# Altium project MAIN.PrjPcb (part 1 of 2)
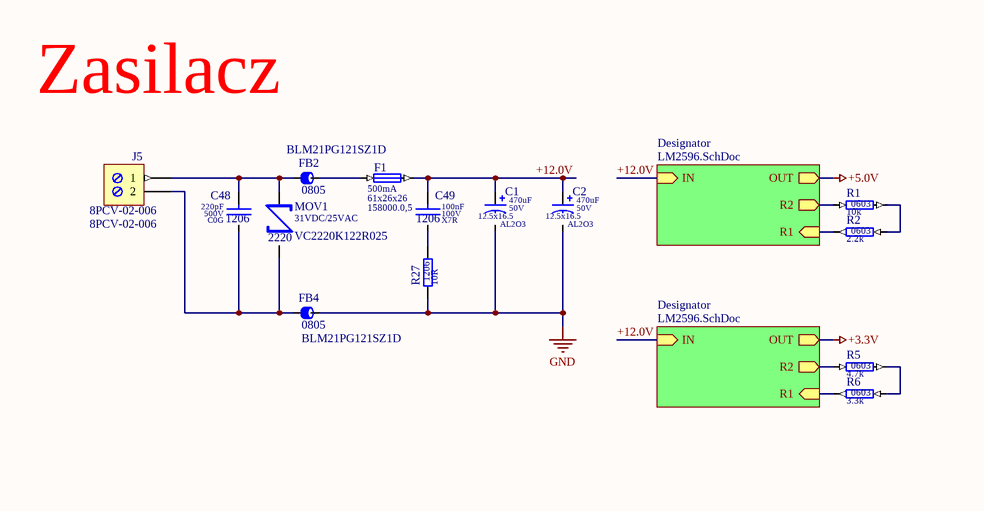
[diagram p0: MAIN.SchDoc, top left]
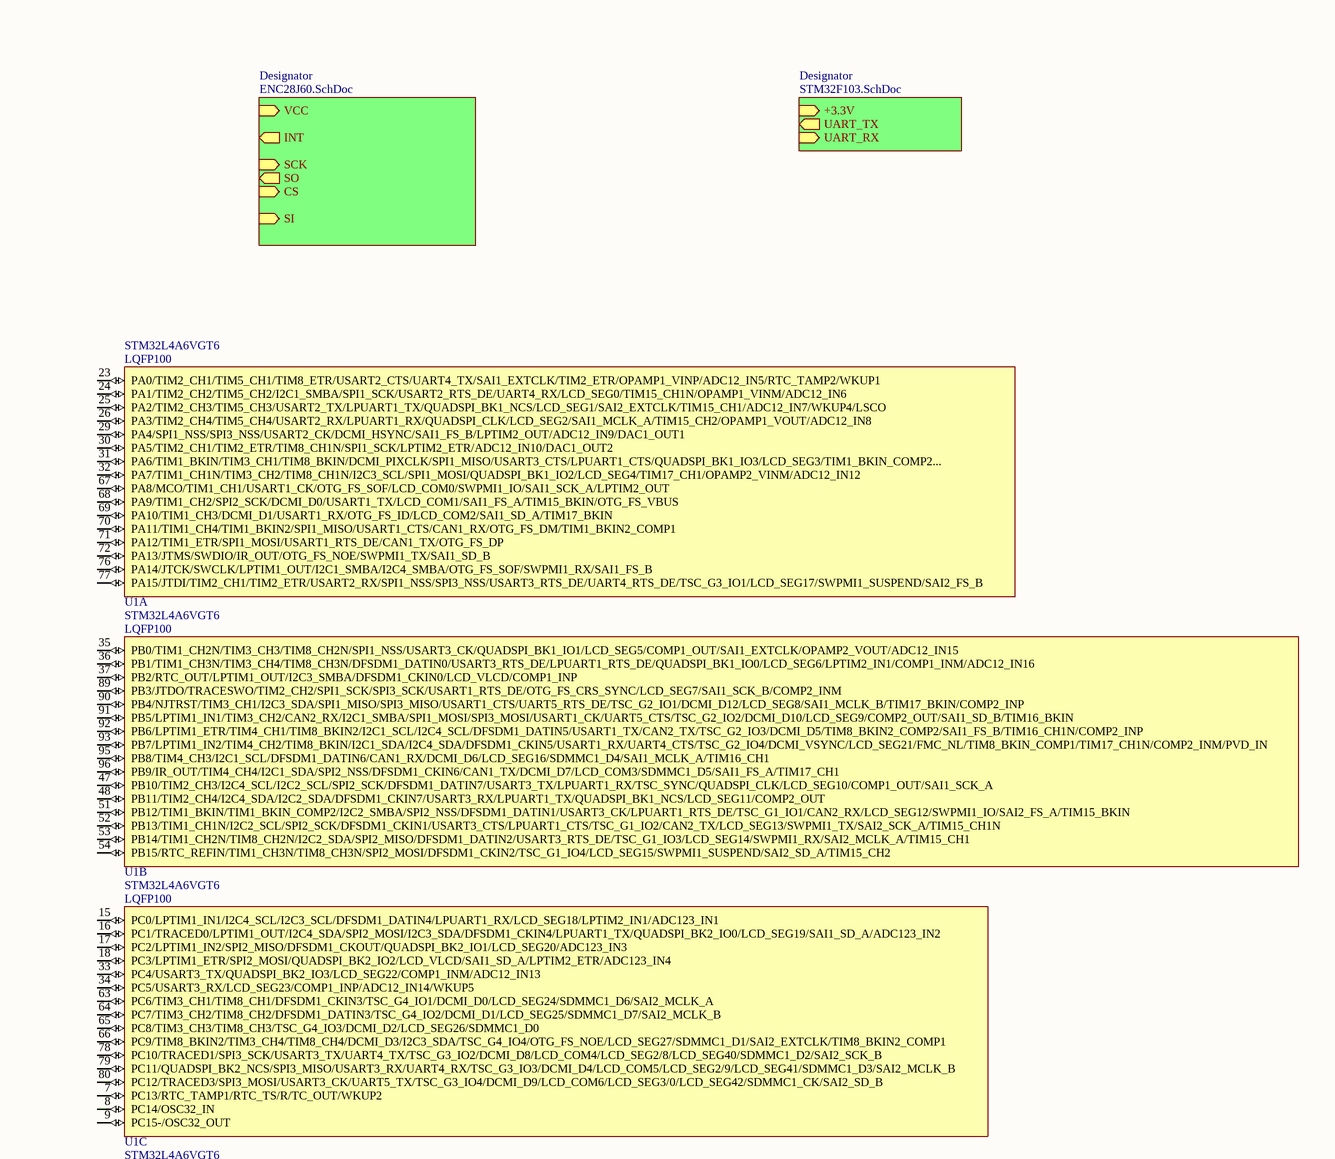
[diagram p1: MAIN.SchDoc, top right]
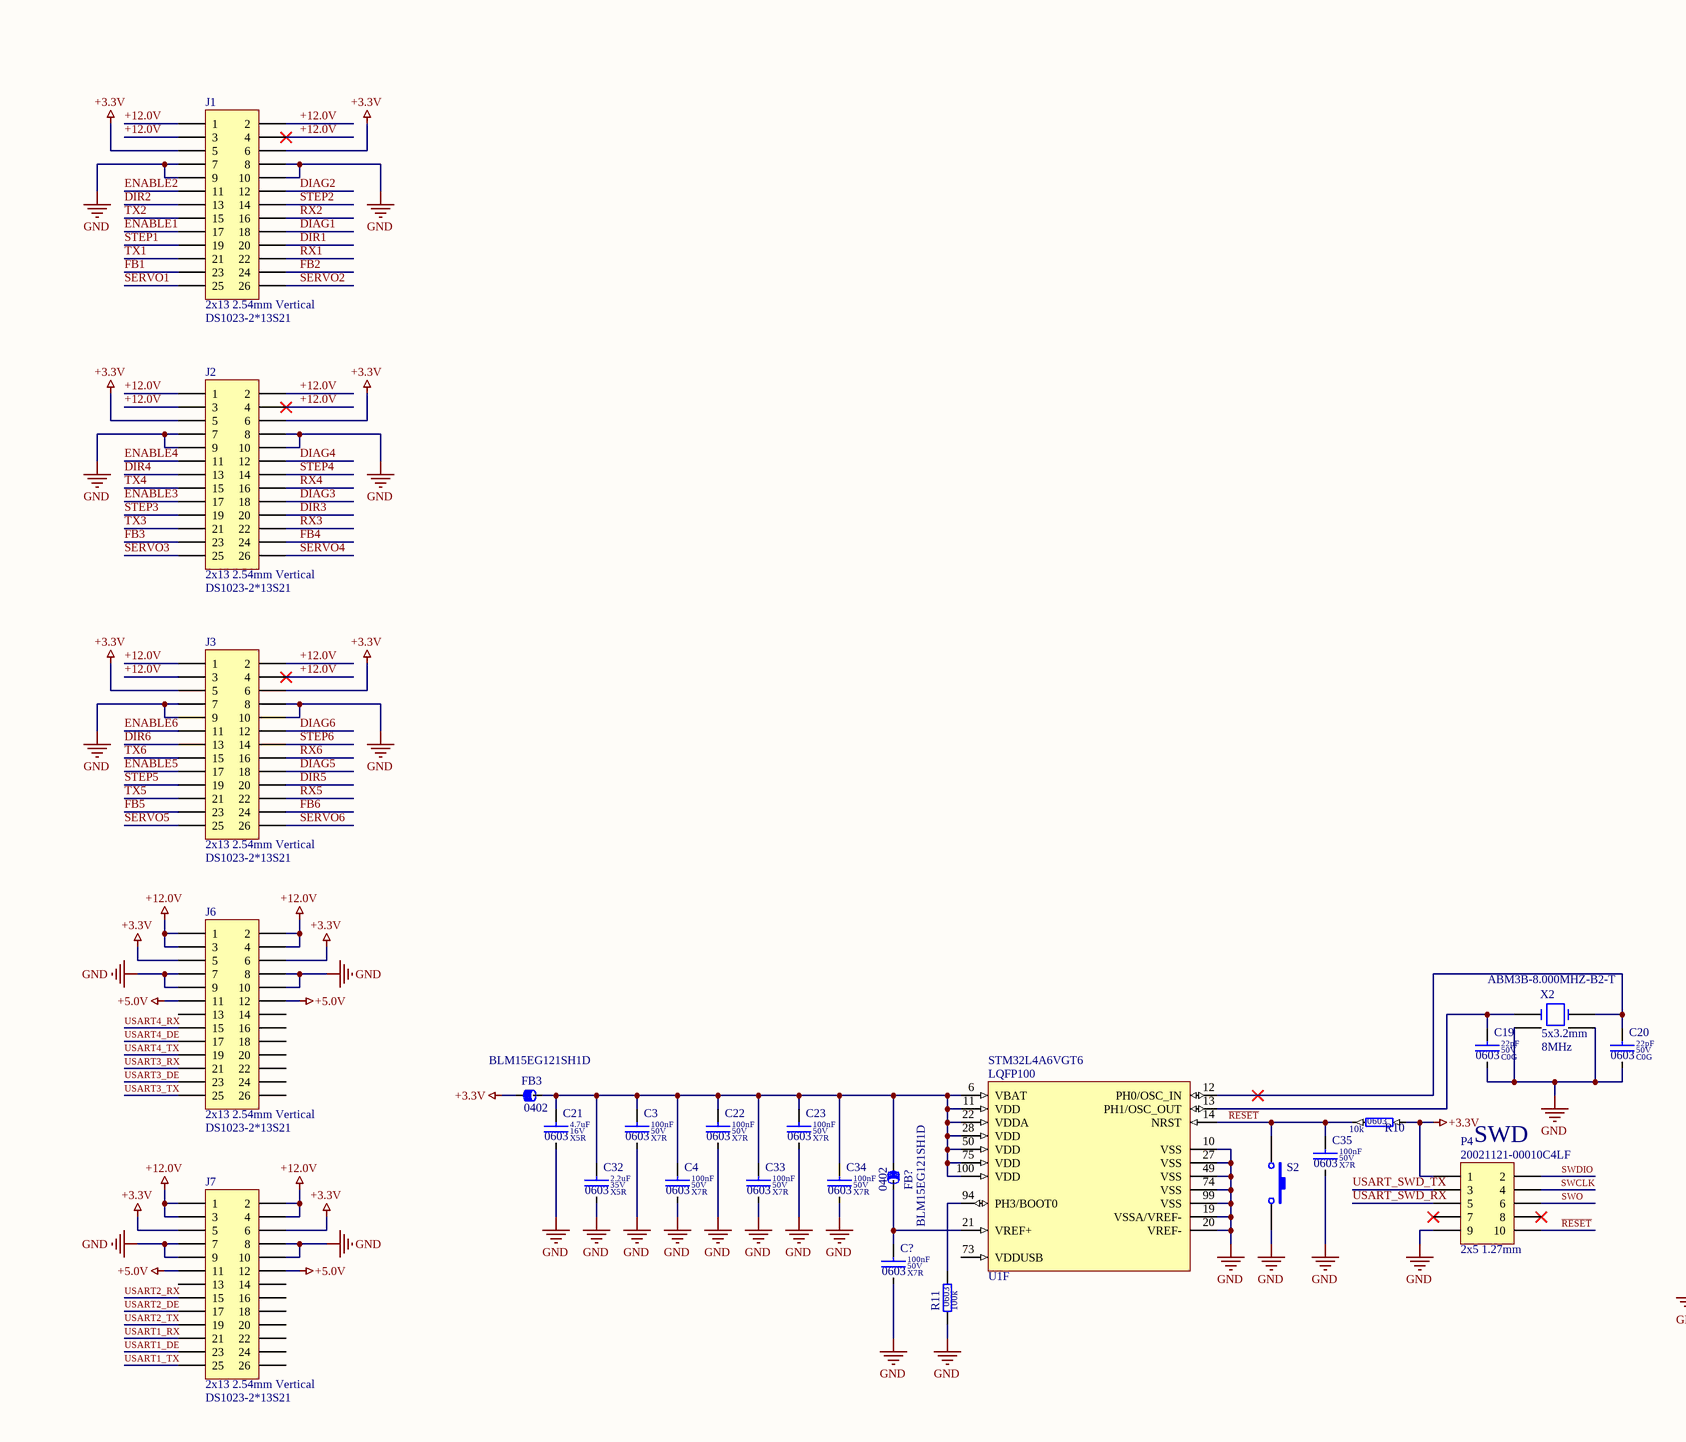
[diagram p2: MAIN.SchDoc, bottom left]
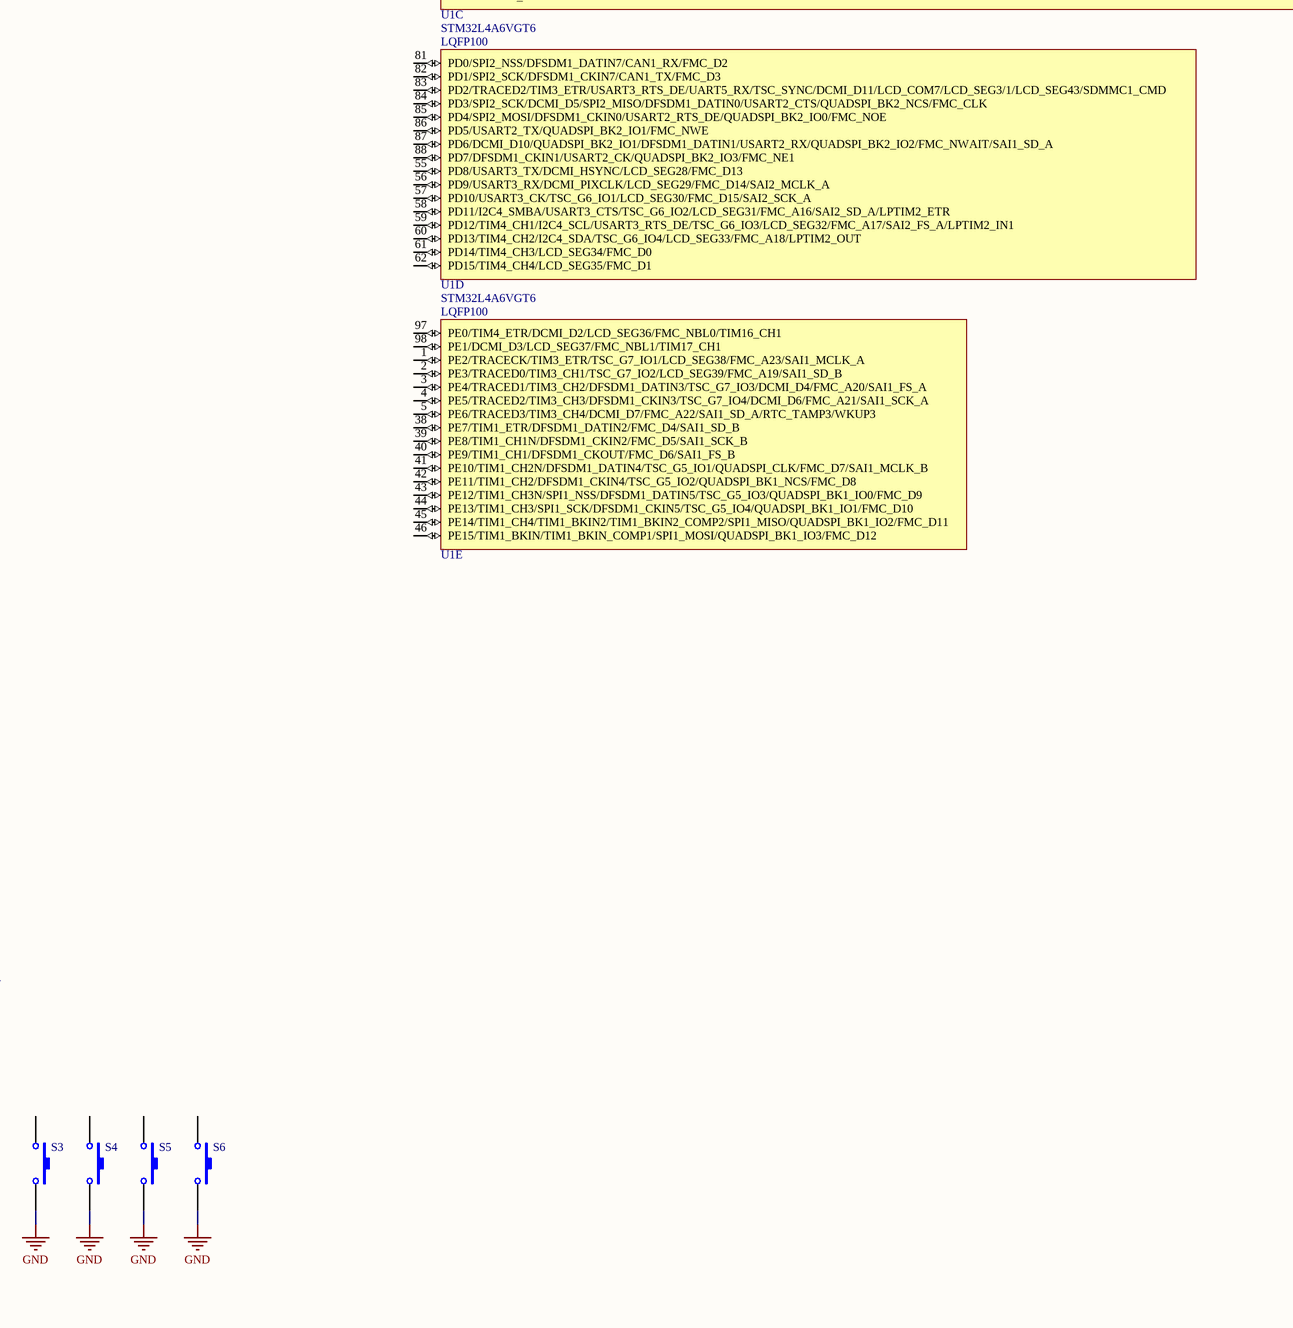
[diagram p3: MAIN.SchDoc, bottom right]
5 sheets, 129 parts. Net scope: hierarchical (ports join the sheet entries above them; power ports are global).
Board file: MAIN.PcbDoc
Sheets:
  MAIN.SchDoc
    Designator = STM32F103.SchDoc
      Designator = VL53L0X.SchDoc
      Designator = VL53L0X.SchDoc
      Designator = VL53L0X.SchDoc
      Designator = VL53L0X.SchDoc
      Designator = VL53L0X.SchDoc
      Designator = VL53L0X.SchDoc
    Designator = ENC28J60.SchDoc
    Designator = LM2596.SchDoc
    Designator = LM2596.SchDoc

## Sheet MAIN.SchDoc
size A1

### Parts
(Parts that share a designator on the sheet are numbered #1, #2 ... from top to bottom, then left to right.)
C1  value 470uF  Dielectric: AL2O3  SCH_Footprint: 12.5x16.5  Voltage: 50V  [CE_D_12.5x16.5MM]  (hidden comment: Electrolytic Capacitor)
C2  value 470uF  Dielectric: AL2O3  SCH_Footprint: 12.5x16.5  Voltage: 50V  [CE_D_12.5x16.5MM]  (hidden comment: Electrolytic Capacitor)
C3  value 100nF  Dielectric: X7R  Voltage: 50V  SCH_Footprint: 0603  [C_0603_1608]  (hidden comment: Ceramic X7R)
C4  value 100nF  Dielectric: X7R  Voltage: 50V  SCH_Footprint: 0603  [C_0603_1608]  (hidden comment: Ceramic X7R)
C19  value 22pF  Dielectric: C0G  Voltage: 50V  SCH_Footprint: 0603  [C_0603_1608]  (hidden comment: Ceramic C0G)
C20  value 22pF  Dielectric: C0G  Voltage: 50V  SCH_Footprint: 0603  [C_0603_1608]  (hidden comment: Ceramic C0G)
C21  value 4.7uF  Dielectric: X5R  Voltage: 16V  SCH_Footprint: 0603  [C_0603_1608]  (hidden comment: Ceramic X5R)
C22  value 100nF  Dielectric: X7R  Voltage: 50V  SCH_Footprint: 0603  [C_0603_1608]  (hidden comment: Ceramic X7R)
C23  value 100nF  Dielectric: X7R  Voltage: 50V  SCH_Footprint: 0603  [C_0603_1608]  (hidden comment: Ceramic X7R)
C32  value 2.2uF  Dielectric: X5R  Voltage: 35V  SCH_Footprint: 0603  [C_0603_1608]  (hidden comment: Ceramic X5R)
C33  value 100nF  Dielectric: X7R  Voltage: 50V  SCH_Footprint: 0603  [C_0603_1608]  (hidden comment: Ceramic X7R)
C34  value 100nF  Dielectric: X7R  Voltage: 50V  SCH_Footprint: 0603  [C_0603_1608]  (hidden comment: Ceramic X7R)
C35  value 100nF  Dielectric: X7R  Voltage: 50V  SCH_Footprint: 0603  [C_0603_1608]  (hidden comment: Ceramic X7R)
C48  value 220pF  Dielectric: C0G  Voltage: 500V  SCH_Footprint: 1206  [C_1206_3216]  (hidden comment: Ceramic C0G)
C49  value 100nF  Dielectric: X7R  Voltage: 100V  SCH_Footprint: 1206  [C_1206_3216]  (hidden comment: Ceramic X7R)
C?  value 100nF  Dielectric: X7R  Voltage: 50V  SCH_Footprint: 0603  [C_0603_1608]  (hidden comment: Ceramic X7R)
F1  value 158000.0,5  SCH_Footprint: 61x26x26  Current: 500mA  [F_SIBA_61x26x26_M]  (hidden comment: Fuse)
FB2  value BLM21PG121SZ1D  SCH_Footprint: 0805  [FB_0805_2012]  (hidden comment: Ferrite bead)
FB3  value BLM15EG121SH1D  SCH_Footprint: 0402  [FB_0402_1005]  (hidden comment: Ferrite bead)
FB4  value BLM21PG121SZ1D  SCH_Footprint: 0805  [FB_0805_2012]  (hidden comment: Ferrite bead)
FB?  value BLM15EG121SH1D  SCH_Footprint: 0402  [FB_0402_1005]  (hidden comment: Ferrite bead)
J1  value DS1023-2*13S21  SCH_Footprint: 2x13 2.54mm Vertical  [J_HEADER_2x13_2.54_VERTICAL]  (hidden comment: Goldpin female straight)
J2  value DS1023-2*13S21  SCH_Footprint: 2x13 2.54mm Vertical  [J_HEADER_2x13_2.54_VERTICAL]  (hidden comment: Goldpin female straight)
J3  value DS1023-2*13S21  SCH_Footprint: 2x13 2.54mm Vertical  [J_HEADER_2x13_2.54_VERTICAL]  (hidden comment: Goldpin female straight)
J5  value 8PCV-02-006  [J_8PCV-02-006]  (hidden comment: 600V 30A connector)
J6  value DS1023-2*13S21  SCH_Footprint: 2x13 2.54mm Vertical  [J_HEADER_2x13_2.54_VERTICAL]  (hidden comment: Goldpin female straight)
J7  value DS1023-2*13S21  SCH_Footprint: 2x13 2.54mm Vertical  [J_HEADER_2x13_2.54_VERTICAL]  (hidden comment: Goldpin female straight)
MOV1  Voltage: 31VDC/25VAC  [MOV_2220_5650]  (hidden comment: VC2220K122R025)
P4  value 20021121-00010C4LF  SCH_Footprint: 2x5 1.27mm  [P_HEADER_2x5_1.27]  (hidden comment: Jtag)
R1  value 10k  SCH_Footprint: 0603  [R_0603_1608]  (hidden comment: Resistor)
R2  value 2.2k  SCH_Footprint: 0603  [R_NC_0603_1608]  (hidden comment: Resistor)
R5#1  value 4.7k  SCH_Footprint: 0603  [R_0603_1608]  (hidden comment: Resistor)
R6  value 3.3k  SCH_Footprint: 0603  [R_0603_1608]  (hidden comment: Resistor)
R10  value 10k  SCH_Footprint: 0603  [R_0603_1608]  (hidden comment: Resistor)
R11  value 100k  SCH_Footprint: 0603  [R_0603_1608]  (hidden comment: Resistor)
R27  value 10R  SCH_Footprint: 1206  [R_1206_3216]  (hidden comment: Resistor)
S2  3x6mm  [S_TACTSWITCH3x6]  (value not drawn)
S3  3x6mm  [S_TACTSWITCH3x6]  (value not drawn)
S4  3x6mm  [S_TACTSWITCH3x6]  (value not drawn)
S5  3x6mm  [S_TACTSWITCH3x6]  (value not drawn)
S6  3x6mm  [S_TACTSWITCH3x6]  (value not drawn)
U1  SCH_Footprint: LQFP100  [LQFP100_14x14]  (hidden comment: STM32L4A6VGT6)  (parts A,B,C,D,E,F of 6)
X2  Manufacturer Part Number: ABM3B-8.000MHZ-B2-T  SCH_Footprint: 5x3.2mm  [X_ABM3B_5X3X11]  (hidden comment: 8MHz)

### Sub-sheets
Designator = STM32F103.SchDoc: +3.3V (in), UART_TX (out), UART_RX (in)
Designator = ENC28J60.SchDoc: SI (in), INT (out), SCK (in), VCC (in), SO (out), CS (in)
Designator = LM2596.SchDoc: OUT (out), R2 (out), R1 (in), IN (in)
Designator = LM2596.SchDoc: OUT (out), R2 (out), R1 (in), IN (in)

### Nets
+3.3V: FB3.1 J1.5 J1.6 J2.5 J2.6 J3.5 J3.6 J6.5 J6.6 J7.5 J7.6 P4.1 R5#1.1 R10.1 ; sheet Designator/OUT, sheet Designator/R2
+5.0V: J6.11 J6.12 J7.11 J7.12 R1.1 ; sheet Designator/OUT, sheet Designator/R2
+12.0V: C1.1 C2.1 C49.1 F1.2 J1.1 J1.2 J1.3 J1.4 J2.1 J2.2 J2.3 J2.4 J3.1 J3.2 J3.3 J3.4 J6.1 J6.2 J6.3 J6.4 J7.1 J7.2 J7.3 J7.4 ; sheet Designator/IN, sheet Designator/IN
GND: C1.2 C2.2 C3.2 C4.2 C19.2 C20.2 C21.2 C22.2 C23.2 C32.2 C33.2 C34.2 C35.2 C?.2 FB4.2 J1.7 J1.8 J1.9 J1.10 J2.7 J2.8 J2.9 J2.10 J3.7 J3.8 J3.9 J3.10 J6.7 J6.8 J6.9 J6.10 J7.7 J7.8 J7.9 J7.10 P4.9 R11.1 R27.1 S2.2 S3.2 S4.2 S5.2 S6.2 U1.10(VSS) U1.19(VSSA/VREF-) U1.20(VREF-) U1.27(VSS) U1.49(VSS) U1.74(VSS) U1.99(VSS) X2.2(GND) X2.4(GND)
DIAG1: J1.18
DIAG2: J1.12
DIAG3: J2.18
DIAG4: J2.12
DIAG5: J3.18
DIAG6: J3.12
DIR1: J1.20
DIR2: J1.13
DIR3: J2.20
DIR4: J2.13
DIR5: J3.20
DIR6: J3.13
ENABLE1: J1.17
ENABLE2: J1.11
ENABLE3: J2.17
ENABLE4: J2.11
ENABLE5: J3.17
ENABLE6: J3.11
FB1: J1.23
FB2: J1.24
FB3: J2.23
FB4: J2.24
FB5: J3.23
FB6: J3.24
~{RESET}: C35.1 P4.10 R10.2 S2.1 U1.14(NRST)
RX1: J1.22
RX2: J1.16
RX3: J2.22
RX4: J2.16
RX5: J3.22
RX6: J3.16
SERVO1: J1.25
SERVO2: J1.26
SERVO3: J2.25
SERVO4: J2.26
SERVO5: J3.25
SERVO6: J3.26
STEP1: J1.19
STEP2: J1.14
STEP3: J2.19
STEP4: J2.14
STEP5: J3.19
STEP6: J3.14
SWCLK: P4.4
SWDIO: P4.2
SWO: P4.6
TX1: J1.21
TX2: J1.15
TX3: J2.21
TX4: J2.15
TX5: J3.21
TX6: J3.15
USART1_DE: J7.23
USART1_RX: J7.21
USART1_TX: J7.25
USART2_DE: J7.17
USART2_RX: J7.15
USART2_TX: J7.19
USART3_DE: J6.23
USART3_RX: J6.21
USART3_TX: J6.25
USART4_DE: J6.17
USART4_RX: J6.15
USART4_TX: J6.19
USART_SWD_RX: P4.5
USART_SWD_TX: P4.3
NetC3_1: C3.1 C4.1 C21.1 C22.1 C23.1 C32.1 C33.1 C34.1 FB3.2 FB?.1 U1.6(VBAT) U1.11(VDD) U1.22(VDDA) U1.28(VDD) U1.50(VDD) U1.75(VDD) U1.100(VDD)
NetC19_1: C19.1 U1.13(PH1/OSC_OUT) X2.3
NetC20_1: C20.1 U1.12(PH0/OSC_IN) X2.1
NetC48_1: C48.1 FB2.1 J5.1 MOV1.2
NetC48_2: C48.2 FB4.1 J5.2 MOV1.1
NetC49_2: C49.2 R27.2
NetC?_1: C?.1 FB?.2 U1.21(VREF+)
NetF1_1: F1.1 FB2.2
NetR1_2: R1.2 R2.2
NetR2_1: R2.1 ; sheet Designator/R1
NetR5#1_2: R5#1.2 R6.2
NetR6_1: R6.1 ; sheet Designator/R1
NetR11_2: R11.2 U1.94(PH3/BOOT0)

Not connected (* = marked no-connect by the designer): J6 13 14 16 18 20 22 24 26; J7 13 14 16 18 20 22 24 26; P4 7* 8*; S3 1; S4 1; S5 1; S6 1; U1 1(PE2/TRACECK/TIM3_ETR/TSC_G7_IO1/LCD_SEG38/FMC_A23/SAI1_MCLK_A) 2(PE3/TRACED0/TIM3_CH1/TSC_G7_IO2/LCD_SEG39/FMC_A19/SAI1_SD_B) 3(PE4/TRACED1/TIM3_CH2/DFSDM1_DATIN3/TSC_G7_IO3/DCMI_D4/FMC_A20/SAI1_FS_A) 4(PE5/TRACED2/TIM3_CH3/DFSDM1_CKIN3/TSC_G7_IO4/DCMI_D6/FMC_A21/SAI1_SCK_A) 5(PE6/TRACED3/TIM3_CH4/DCMI_D7/FMC_A22/SAI1_SD_A/RTC_TAMP3/WKUP3) 7(PC13/RTC_TAMP1/RTC_TS/R/TC_OUT/WKUP2) 8(PC14/OSC32_IN) 9(PC15-/OSC32_OUT) 15(PC0/LPTIM1_IN1/I2C4_SCL/I2C3_SCL/DFSDM1_DATIN4/LPUART1_RX/LCD_SEG18/LPTIM2_IN1/ADC123_IN1) 16(PC1/TRACED0/LPTIM1_OUT/I2C4_SDA/SPI2_MOSI/I2C3_SDA/DFSDM1_CKIN4/LPUART1_TX/QUADSPI_BK2_IO0/LCD_SEG19/SAI1_SD_A/ADC123_IN2) 17(PC2/LPTIM1_IN2/SPI2_MISO/DFSDM1_CKOUT/QUADSPI_BK2_IO1/LCD_SEG20/ADC123_IN3) 18(PC3/LPTIM1_ETR/SPI2_MOSI/QUADSPI_BK2_IO2/LCD_VLCD/SAI1_SD_A/LPTIM2_ETR/ADC123_IN4) 23(PA0/TIM2_CH1/TIM5_CH1/TIM8_ETR/USART2_CTS/UART4_TX/SAI1_EXTCLK/TIM2_ETR/OPAMP1_VINP/ADC12_IN5/RTC_TAMP2/WKUP1) 24(PA1/TIM2_CH2/TIM5_CH2/I2C1_SMBA/SPI1_SCK/USART2_RTS_DE/UART4_RX/LCD_SEG0/TIM15_CH1N/OPAMP1_VINM/ADC12_IN6) 25(PA2/TIM2_CH3/TIM5_CH3/USART2_TX/LPUART1_TX/QUADSPI_BK1_NCS/LCD_SEG1/SAI2_EXTCLK/TIM15_CH1/ADC12_IN7/WKUP4/LSCO) 26(PA3/TIM2_CH4/TIM5_CH4/USART2_RX/LPUART1_RX/QUADSPI_CLK/LCD_SEG2/SAI1_MCLK_A/TIM15_CH2/OPAMP1_VOUT/ADC12_IN8) 29(PA4/SPI1_NSS/SPI3_NSS/USART2_CK/DCMI_HSYNC/SAI1_FS_B/LPTIM2_OUT/ADC12_IN9/DAC1_OUT1) 30(PA5/TIM2_CH1/TIM2_ETR/TIM8_CH1N/SPI1_SCK/LPTIM2_ETR/ADC12_IN10/DAC1_OUT2) 31(PA6/TIM1_BKIN/TIM3_CH1/TIM8_BKIN/DCMI_PIXCLK/SPI1_MISO/USART3_CTS/LPUART1_CTS/QUADSPI_BK1_IO3/LCD_SEG3/TIM1_BKIN_COMP2...) 32(PA7/TIM1_CH1N/TIM3_CH2/TIM8_CH1N/I2C3_SCL/SPI1_MOSI/QUADSPI_BK1_IO2/LCD_SEG4/TIM17_CH1/OPAMP2_VINM/ADC12_IN12) 33(PC4/USART3_TX/QUADSPI_BK2_IO3/LCD_SEG22/COMP1_INM/ADC12_IN13) 34(PC5/USART3_RX/LCD_SEG23/COMP1_INP/ADC12_IN14/WKUP5) 35(PB0/TIM1_CH2N/TIM3_CH3/TIM8_CH2N/SPI1_NSS/USART3_CK/QUADSPI_BK1_IO1/LCD_SEG5/COMP1_OUT/SAI1_EXTCLK/OPAMP2_VOUT/ADC12_IN15) 36(PB1/TIM1_CH3N/TIM3_CH4/TIM8_CH3N/DFSDM1_DATIN0/USART3_RTS_DE/LPUART1_RTS_DE/QUADSPI_BK1_IO0/LCD_SEG6/LPTIM2_IN1/COMP1_INM/ADC12_IN16) 37(PB2/RTC_OUT/LPTIM1_OUT/I2C3_SMBA/DFSDM1_CKIN0/LCD_VLCD/COMP1_INP) 38(PE7/TIM1_ETR/DFSDM1_DATIN2/FMC_D4/SAI1_SD_B) 39(PE8/TIM1_CH1N/DFSDM1_CKIN2/FMC_D5/SAI1_SCK_B) 40(PE9/TIM1_CH1/DFSDM1_CKOUT/FMC_D6/SAI1_FS_B) 41(PE10/TIM1_CH2N/DFSDM1_DATIN4/TSC_G5_IO1/QUADSPI_CLK/FMC_D7/SAI1_MCLK_B) 42(PE11/TIM1_CH2/DFSDM1_CKIN4/TSC_G5_IO2/QUADSPI_BK1_NCS/FMC_D8) 43(PE12/TIM1_CH3N/SPI1_NSS/DFSDM1_DATIN5/TSC_G5_IO3/QUADSPI_BK1_IO0/FMC_D9) 44(PE13/TIM1_CH3/SPI1_SCK/DFSDM1_CKIN5/TSC_G5_IO4/QUADSPI_BK1_IO1/FMC_D10) 45(PE14/TIM1_CH4/TIM1_BKIN2/TIM1_BKIN2_COMP2/SPI1_MISO/QUADSPI_BK1_IO2/FMC_D11) 46(PE15/TIM1_BKIN/TIM1_BKIN_COMP1/SPI1_MOSI/QUADSPI_BK1_IO3/FMC_D12) 47(PB10/TIM2_CH3/I2C4_SCL/I2C2_SCL/SPI2_SCK/DFSDM1_DATIN7/USART3_TX/LPUART1_RX/TSC_SYNC/QUADSPI_CLK/LCD_SEG10/COMP1_OUT/SAI1_SCK_A) 48(PB11/TIM2_CH4/I2C4_SDA/I2C2_SDA/DFSDM1_CKIN7/USART3_RX/LPUART1_TX/QUADSPI_BK1_NCS/LCD_SEG11/COMP2_OUT) 51(PB12/TIM1_BKIN/TIM1_BKIN_COMP2/I2C2_SMBA/SPI2_NSS/DFSDM1_DATIN1/USART3_CK/LPUART1_RTS_DE/TSC_G1_IO1/CAN2_RX/LCD_SEG12/SWPMI1_IO/SAI2_FS_A/TIM15_BKIN) 52(PB13/TIM1_CH1N/I2C2_SCL/SPI2_SCK/DFSDM1_CKIN1/USART3_CTS/LPUART1_CTS/TSC_G1_IO2/CAN2_TX/LCD_SEG13/SWPMI1_TX/SAI2_SCK_A/TIM15_CH1N) 53(PB14/TIM1_CH2N/TIM8_CH2N/I2C2_SDA/SPI2_MISO/DFSDM1_DATIN2/USART3_RTS_DE/TSC_G1_IO3/LCD_SEG14/SWPMI1_RX/SAI2_MCLK_A/TIM15_CH1) 54(PB15/RTC_REFIN/TIM1_CH3N/TIM8_CH3N/SPI2_MOSI/DFSDM1_CKIN2/TSC_G1_IO4/LCD_SEG15/SWPMI1_SUSPEND/SAI2_SD_A/TIM15_CH2) 55(PD8/USART3_TX/DCMI_HSYNC/LCD_SEG28/FMC_D13) 56(PD9/USART3_RX/DCMI_PIXCLK/LCD_SEG29/FMC_D14/SAI2_MCLK_A) 57(PD10/USART3_CK/TSC_G6_IO1/LCD_SEG30/FMC_D15/SAI2_SCK_A) 58(PD11/I2C4_SMBA/USART3_CTS/TSC_G6_IO2/LCD_SEG31/FMC_A16/SAI2_SD_A/LPTIM2_ETR) 59(PD12/TIM4_CH1/I2C4_SCL/USART3_RTS_DE/TSC_G6_IO3/LCD_SEG32/FMC_A17/SAI2_FS_A/LPTIM2_IN1) 60(PD13/TIM4_CH2/I2C4_SDA/TSC_G6_IO4/LCD_SEG33/FMC_A18/LPTIM2_OUT) 61(PD14/TIM4_CH3/LCD_SEG34/FMC_D0) 62(PD15/TIM4_CH4/LCD_SEG35/FMC_D1) 63(PC6/TIM3_CH1/TIM8_CH1/DFSDM1_CKIN3/TSC_G4_IO1/DCMI_D0/LCD_SEG24/SDMMC1_D6/SAI2_MCLK_A) 64(PC7/TIM3_CH2/TIM8_CH2/DFSDM1_DATIN3/TSC_G4_IO2/DCMI_D1/LCD_SEG25/SDMMC1_D7/SAI2_MCLK_B) 65(PC8/TIM3_CH3/TIM8_CH3/TSC_G4_IO3/DCMI_D2/LCD_SEG26/SDMMC1_D0) 66(PC9/TIM8_BKIN2/TIM3_CH4/TIM8_CH4/DCMI_D3/I2C3_SDA/TSC_G4_IO4/OTG_FS_NOE/LCD_SEG27/SDMMC1_D1/SAI2_EXTCLK/TIM8_BKIN2_COMP1) 67(PA8/MCO/TIM1_CH1/USART1_CK/OTG_FS_SOF/LCD_COM0/SWPMI1_IO/SAI1_SCK_A/LPTIM2_OUT) 68(PA9/TIM1_CH2/SPI2_SCK/DCMI_D0/USART1_TX/LCD_COM1/SAI1_FS_A/TIM15_BKIN/OTG_FS_VBUS) 69(PA10/TIM1_CH3/DCMI_D1/USART1_RX/OTG_FS_ID/LCD_COM2/SAI1_SD_A/TIM17_BKIN) 70(PA11/TIM1_CH4/TIM1_BKIN2/SPI1_MISO/USART1_CTS/CAN1_RX/OTG_FS_DM/TIM1_BKIN2_COMP1) 71(PA12/TIM1_ETR/SPI1_MOSI/USART1_RTS_DE/CAN1_TX/OTG_FS_DP) 72(PA13/JTMS/SWDIO/IR_OUT/OTG_FS_NOE/SWPMI1_TX/SAI1_SD_B) 73(VDDUSB) 76(PA14/JTCK/SWCLK/LPTIM1_OUT/I2C1_SMBA/I2C4_SMBA/OTG_FS_SOF/SWPMI1_RX/SAI1_FS_B) 77(PA15/JTDI/TIM2_CH1/TIM2_ETR/USART2_RX/SPI1_NSS/SPI3_NSS/USART3_RTS_DE/UART4_RTS_DE/TSC_G3_IO1/LCD_SEG17/SWPMI1_SUSPEND/SAI2_FS_B) 78(PC10/TRACED1/SPI3_SCK/USART3_TX/UART4_TX/TSC_G3_IO2/DCMI_D8/LCD_COM4/LCD_SEG2/8/LCD_SEG40/SDMMC1_D2/SAI2_SCK_B) 79(PC11/QUADSPI_BK2_NCS/SPI3_MISO/USART3_RX/UART4_RX/TSC_G3_IO3/DCMI_D4/LCD_COM5/LCD_SEG2/9/LCD_SEG41/SDMMC1_D3/SAI2_MCLK_B) 80(PC12/TRACED3/SPI3_MOSI/USART3_CK/UART5_TX/TSC_G3_IO4/DCMI_D9/LCD_COM6/LCD_SEG3/0/LCD_SEG42/SDMMC1_CK/SAI2_SD_B) 81(PD0/SPI2_NSS/DFSDM1_DATIN7/CAN1_RX/FMC_D2) 82(PD1/SPI2_SCK/DFSDM1_CKIN7/CAN1_TX/FMC_D3) 83(PD2/TRACED2/TIM3_ETR/USART3_RTS_DE/UART5_RX/TSC_SYNC/DCMI_D11/LCD_COM7/LCD_SEG3/1/LCD_SEG43/SDMMC1_CMD) 84(PD3/SPI2_SCK/DCMI_D5/SPI2_MISO/DFSDM1_DATIN0/USART2_CTS/QUADSPI_BK2_NCS/FMC_CLK) 85(PD4/SPI2_MOSI/DFSDM1_CKIN0/USART2_RTS_DE/QUADSPI_BK2_IO0/FMC_NOE) 86(PD5/USART2_TX/QUADSPI_BK2_IO1/FMC_NWE) 87(PD6/DCMI_D10/QUADSPI_BK2_IO1/DFSDM1_DATIN1/USART2_RX/QUADSPI_BK2_IO2/FMC_NWAIT/SAI1_SD_A) 88(PD7/DFSDM1_CKIN1/USART2_CK/QUADSPI_BK2_IO3/FMC_NE1) 89(PB3/JTDO/TRACESWO/TIM2_CH2/SPI1_SCK/SPI3_SCK/USART1_RTS_DE/OTG_FS_CRS_SYNC/LCD_SEG7/SAI1_SCK_B/COMP2_INM) 90(PB4/NJTRST/TIM3_CH1/I2C3_SDA/SPI1_MISO/SPI3_MISO/USART1_CTS/UART5_RTS_DE/TSC_G2_IO1/DCMI_D12/LCD_SEG8/SAI1_MCLK_B/TIM17_BKIN/COMP2_INP) 91(PB5/LPTIM1_IN1/TIM3_CH2/CAN2_RX/I2C1_SMBA/SPI1_MOSI/SPI3_MOSI/USART1_CK/UART5_CTS/TSC_G2_IO2/DCMI_D10/LCD_SEG9/COMP2_OUT/SAI1_SD_B/TIM16_BKIN) 92(PB6/LPTIM1_ETR/TIM4_CH1/TIM8_BKIN2/I2C1_SCL/I2C4_SCL/DFSDM1_DATIN5/USART1_TX/CAN2_TX/TSC_G2_IO3/DCMI_D5/TIM8_BKIN2_COMP2/SAI1_FS_B/TIM16_CH1N/COMP2_INP) 93(PB7/LPTIM1_IN2/TIM4_CH2/TIM8_BKIN/I2C1_SDA/I2C4_SDA/DFSDM1_CKIN5/USART1_RX/UART4_CTS/TSC_G2_IO4/DCMI_VSYNC/LCD_SEG21/FMC_NL/TIM8_BKIN_COMP1/TIM17_CH1N/COMP2_INM/PVD_IN) 95(PB8/TIM4_CH3/I2C1_SCL/DFSDM1_DATIN6/CAN1_RX/DCMI_D6/LCD_SEG16/SDMMC1_D4/SAI1_MCLK_A/TIM16_CH1) 96(PB9/IR_OUT/TIM4_CH4/I2C1_SDA/SPI2_NSS/DFSDM1_CKIN6/CAN1_TX/DCMI_D7/LCD_COM3/SDMMC1_D5/SAI1_FS_A/TIM17_CH1) 97(PE0/TIM4_ETR/DCMI_D2/LCD_SEG36/FMC_NBL0/TIM16_CH1) 98(PE1/DCMI_D3/LCD_SEG37/FMC_NBL1/TIM17_CH1)

### Notes on the sheet
- Zasilacz
- (near P4) SWD
- Title
- Size:
- Date:
- File:
- A1
- Number:
- Time:
- Revision:
- Sheet
- of

### Library data of the parts
C1 C2 = CE_470uF_50V_AL2O3_12.5x16.5_20: Polarized Capacitor; Manufacturer: United Chemi-Con; Manufacturer Part Number: EMVA500ARA471MKG5S; Tolerance (%): 20; Part Number: CE_470uF_50V_AL2O3_12.5x16.5_20; HelpURL: https://datasheet.octopart.com/EMVA500ARA471MKG5S-United-Chemi-Con-datasheet-15540548.pdf; Supplier 1: TME; Supplier 2: RS Components; Supplier 3: Farnell; Supplier Part Number 3: 2842044; Supplier 4: Mouser; Supplier Part Number 4: 661-EMVA500ARA471MKG; Supplier 5: Digi-Key; Supplier Part Number 5: 565-2136-1-ND; Supplier 6: LCSC
C3 C4 C22 C23 C33-C35 C? = C_100nF_50V_X7R_0603_5: Capacitor; Manufacturer: Samsung; Manufacturer Part Number: CL10B104JB8NNNC; Tolerance (%): 5; Part Number: C_100nF_50V_X7R_0603_5; HelpURL: http://www.tme.eu/pl/Document/4a42202b32dab16128fe107dd69598cc/samsung-chip-cap.pdf; Supplier 1: TME; Supplier Part Number 1: CL10B104JB8NNNC; Supplier 2: RS Components; Supplier Part Number 2: 7665455; Supplier 3: Farnell; Supplier 4: Mouser; Supplier 5: Digi-Key; Supplier Part Number 5: 1276-1033-1-ND; Supplier 6: LCSC; Supplier Part Number 6: C24452
C19 C20 = C_22pF_50V_C0G_0603_5: Capacitor; Manufacturer: Yageo; Manufacturer Part Number: CC0603JRNPO9BN220; Tolerance (%): 5; Part Number: C_22pF_50V_C0G_0603_5; HelpURL: https://datasheet.octopart.com/CC0603JRNPO9BN220-Yageo-datasheet-136957424.pdf; Supplier 1: TME; Supplier Part Number 1: CC0603JRNPO9220; Supplier 2: RS Components; Supplier 3: Farnell; Supplier Part Number 3: 722005; Supplier 4: Mouser; Supplier Part Number 4: 603-CC603JRNPO9BN220; Supplier 5: Digi-Key; Supplier Part Number 5: 311-1062-1-ND; Supplier 6: LCSC
C21 = C_4.7uF_16V_X5R_0603_10: Capacitor; Manufacturer: Murata; Manufacturer Part Number: GRM188R61C475KAAJD; Tolerance (%): 10; Part Number: C_4.7uF_16V_X5R_0603_10; HelpURL: https://datasheet.octopart.com/GRM188R61C475KAAJD-Murata-datasheet-66077093.pdf; Supplier 1: TME; Supplier 2: RS Components; Supplier Part Number 2: 884-7264P; Supplier 3: Farnell; Supplier Part Number 3: 2611924; Supplier 4: Mouser; Supplier Part Number 4: 81-GRM188R61C475KAJD; Supplier 5: Digi-Key; Supplier Part Number 5: 490-10481-2-ND; Supplier 6: LCSC
C32 = C_2.2uF_35V_X5R_0603_10: Capacitor; Manufacturer: Murata; Manufacturer Part Number: GRM188R6YA225KA12D; Tolerance (%): 10; Part Number: C_2.2uF_35V_X5R_0603_10; HelpURL: https://datasheet.octopart.com/GRM188R6YA225KA12D-Murata-datasheet-66077095.pdf; Supplier 1: TME; Supplier 2: RS Components; Supplier Part Number 2: 8151358; Supplier 3: Farnell; Supplier Part Number 3: 2611926; Supplier 4: Mouser; Supplier Part Number 4: 81-GRM188R6YA225KA2D; Supplier 5: Digi-Key; Supplier Part Number 5: 490-7204-1-ND; Supplier 6: LCSC
C48 = C_220pF_500V_C0G_1206_5: Capacitor; Manufacturer: AVX; Manufacturer Part Number: 12067A221JAT2A; Tolerance (%): 5; Part Number: C_220pF_500V_C0G_1206_5; HelpURL: http://datasheet.octopart.com/12067A221JAT2A-AVX-datasheet-9883399.pdf; Supplier 1: TME; Supplier 2: RS Components; Supplier Part Number 2: 391022; Supplier 3: Farnell; Supplier Part Number 3: 2281102; Supplier 4: Mouser; Supplier Part Number 4: 581-12067A221J; Supplier 5: Digi-Key; Supplier Part Number 5: 478-5785-1-ND; Supplier 6: LCSC
C49 = C_100nF_100V_X7R_1206_10: Capacitor; Manufacturer: Samsung; Manufacturer Part Number: CL31B104KCFNNNE; Tolerance (%): 10; Part Number: C_100nF_100V_X7R_1206_10; HelpURL: https://datasheet.octopart.com/CL31B104KCFNNNE-Samsung-datasheet-8331463.pdf; Supplier 1: TME; Supplier 2: RS Components; Supplier 3: Farnell; Supplier 4: Mouser; Supplier 5: Digi-Key; Supplier 6: LCSC
F1 = F_500mA_125V_61x26x26: Manufacturer: Siba; Voltage: 125V; Part Number: F_500mA_125V_61x26x26; HelpURL: https://www.tme.eu/Document/2b36e94e6d725b87cfb40ef3a8fef910/SIBA-GSS-158000.pdf; Manufacturer Part Number: 158000.0,5; Supplier 1: TME; Supplier Part Number 1: BSMD-T0.5A; Supplier 2: RS Components; Supplier 3: Farnell; Supplier 4: Mouser; Supplier 5: Digi-Key; Supplier 6: LCSC
FB2 FB4 = FB_BLM21PG121SZ1D: Manufacturer: Murata; Current: 3A; Resistance: 30mR; Part Number: FB_BLM21PG121SZ1D; HelpURL: https://datasheet.octopart.com/BLM21PG121SZ1D-Murata-datasheet-138707404.pdf; Manufacturer Part Number: BLM21PG121SZ1D; Supplier 1: TME; Supplier 2: RS Components; Supplier 3: Farnell; Supplier Part Number 3: 3352923; Supplier 4: Mouser; Supplier Part Number 4: 81-BLM21PG121SZ1D; Supplier 5: Digi-Key; Supplier Part Number 5: 490-18101-1-ND; Supplier 6: LCSC
FB3 FB? = FB_BLM15EG121SH1D: Manufacturer: Murata; Current: 1.5A; Resistance: 95mR; Part Number: FB_BLM15EG121SH1D; HelpURL: http://datasheet.octopart.com/BLM15EG121SH1D-Murata-datasheet-37129980.pdf; Manufacturer Part Number: BLM15EG121SH1D; Supplier 1: TME; Supplier 2: RS Components; Supplier 3: Farnell; Supplier Part Number 3: 2871614; Supplier 4: Mouser; Supplier Part Number 4: 81-BLM15EG121SH1D; Supplier 5: Digi-Key; Supplier Part Number 5: 490-17344-1-ND; Supplier 6: LCSC
J1-J3 J6 J7 = J_HEADER_2x13_2.54_VERTICAL: Pin Header; Manufacturer: Connfly; Part Number: J_HEADER_2x13_2.54_VERTICAL; HelpURL: https://datasheet.octopart.com/DS1023-2%2A13S21-Connfly-datasheet-81850794.pdf; Manufacturer Part Number: DS1023-2*13S21; Supplier 1: TME; Supplier Part Number 1: DS1023-2*13S21; Supplier 2: RS Components; Supplier 3: Farnell; Supplier 4: Mouser; Supplier 5: Digi-Key; Supplier 6: LCSC
J5 = J_8PCV-02-006: ARK Screw terminal, 2-Pin; Manufacturer: TE Connectivity; SCH_Footprint: 8PCV-02-006; Part Number: J_8PCV-02-006; HelpURL: http://www.mouser.com/ds/2/418/NG_CD_6-1437657-3_K4-669783.pdf; Manufacturer Part Number: 8PCV-02-006; Supplier 1: TME; Supplier 2: RS Components; Supplier Part Number 2: 7176637; Supplier 3: Farnell; Supplier 4: Mouser; Supplier Part Number 4: 571-514376577; Supplier 5: Digi-Key; Supplier Part Number 5: A98460-ND; Supplier 6: LCSC
MOV1 = MOV_31VDC_25VAC_2220: Varistor; Manufacturer: Kemet; SCH_Footprint: 2220; Part Number: MOV_31VDC_25VAC_2220; Value: VC2220K122R025; HelpURL: http://datasheet.octopart.com/VC2220K501R130-KEMET-datasheet-86450646.pdf; Manufacturer Part Number: VC2220K122R025; Supplier 1: TME; Supplier 2: RS Components; Supplier 3: Farnell; Supplier Part Number 3: 2989482; Supplier 4: Mouser; Supplier Part Number 4: 80-VC2220K122R025; Supplier 5: Digi-Key; Supplier Part Number 5: VC2220K122R025-ND; Supplier 6: LCSC
P4 = P_HEADER_2x5_1.27: Pin Header; Manufacturer: FCI; Part Number: P_HEADER_2x5_1.27; HelpURL: http://www.mouser.com/catalog/645/usd/1591.pdf; Manufacturer Part Number: 20021121-00010C4LF; Supplier 1: TME; Supplier Part Number 1: 20021121-00010C4LF; Supplier 2: RS Components; Supplier Part Number 2: 794-4584; Supplier 3: Farnell; Supplier Part Number 3: 1865279; Supplier 4: Mouser; Supplier Part Number 4: 649-202112100010C4LF; Supplier 5: Digi-Key; Supplier Part Number 5: 609-3695-1-ND; Supplier 6: LCSC
R1 R10 = R_10k_0603_1: Manufacturer: Vishay; Manufacturer Part Number: CRCW060310K0FKTABC; Voltage: 75V; Power: 100mW; Tolerance: 1%; Part Number: R_10k_0603_1; HelpURL: http://www.tme.eu/pl/Document/622e28308c06d160637f2b14751ba16b/Data%20Sheet%20CRCW_BCe3.pdf; Supplier 1: TME; Supplier Part Number 1: CRCW060310K0FKTABC; Supplier 2: RS Components; Supplier 3: Farnell; Supplier 4: Mouser; Supplier Part Number 4: 667-ERJ-3EKF1002V; Supplier 5: Digi-Key; Supplier Part Number 5: P10KGCT-ND; Supplier 6: LCSC
R2 = R_GENERIC_0603: Part Number: R_GENERIC_0603; Supplier 1: TME; Supplier 2: RS Components; Supplier 3: Farnell; Supplier 4: Mouser; Supplier 5: Digi-Key; Supplier 6: LCSC
R5#1 = R_4.7k_0603_1: Manufacturer: Yageo; Manufacturer Part Number: RC0603FR-074K7L; Voltage: 75V; Power: 100mW; Tolerance: 1%; Part Number: R_4.7k_0603_1; HelpURL: http://www.farnell.com/datasheets/2167052.pdf?_ga=2.156163131.1690599162.1548417389-1379097396.1542296996&_gac=1.18389067.1547230258.Cj0KCQiAmuHhBRD0ARIsAFWyPwhX8HcvXnM3tA0ZBodZLzDIjH2ZxLpjT5LWo9bad_HPRbU8LfPq44UaAhEwEALw_wcB; Supplier 1: TME; Supplier Part Number 1: RC0603FR-074K7; Supplier 2: RS Components; Supplier 3: Farnell; Supplier Part Number 3: 9238565; Supplier 4: Mouser; Supplier Part Number 4: 603-RC0603FR-074K7L; Supplier 5: Digi-Key; Supplier Part Number 5: 311-4.70KHRCT-ND; Supplier 6: LCSC
R6 = R_3.3k_0603_1: Manufacturer: Vishay; Manufacturer Part Number: CRCW06033K30FKTABC; Voltage: 75V; Power: 100mW; Tolerance: 1%; Part Number: R_3.3k_0603_1; HelpURL: https://www.tme.eu/pl/Document/622e28308c06d160637f2b14751ba16b/Data%20Sheet%20CRCW_BCe3.pdf; Supplier 1: TME; Supplier Part Number 1: CRCW06033K30FKTABC; Supplier 2: RS Components; Supplier 3: Farnell; Supplier 4: Mouser; Supplier Part Number 4: 71-CRCW0603-3.3K; Supplier 5: Digi-Key; Supplier 6: LCSC
R11 = R_100k_0603_1: Manufacturer: Royalohm; Manufacturer Part Number: 0603SAF1003T5E; Voltage: 50V; Power: 100mW; Tolerance: 1%; Part Number: R_100k_0603_1; HelpURL: http://www.tme.eu/pl/Document/b315665a56acbc42df513c99b390ad98/ROYALOHM-THICKFILM.pdf; Supplier 1: TME; Supplier Part Number 1: SMD0603-100K-1%; Supplier 2: RS Components; Supplier 3: Farnell; Supplier 4: Mouser; Supplier Part Number 4: 667-ERJ-3EKF1003V; Supplier 5: Digi-Key; Supplier Part Number 5: P100KHCT-ND; Supplier 6: LCSC
R27 = R_10R_1206_1: Manufacturer: Yageo; Manufacturer Part Number: RC1206FR-0710RL; Voltage: 200V; Power: 250mW; Tolerance: 1%; Part Number: R_10R_1206_1; HelpURL: http://www.farnell.com/datasheets/444357.pdf; Supplier 1: TME; Supplier 2: RS Components; Supplier 3: Farnell; Supplier Part Number 3: 9236643; Supplier 4: Mouser; Supplier Part Number 4: 603-RC1206FR-0710RL; Supplier 5: Digi-Key; Supplier Part Number 5: 311-10.0FRCT-ND; Supplier 6: LCSC
S2-S6 = S_TACTSWITCH: Tact Switch; Manufacturer: Ninigi; Manufacturer Part Number: TACTM-34N-F; Part Number: S_TACTSWITCH; HelpURL: http://pl.ninigi.com/product/tactm-34n-f/pdf; Supplier 1: TME; Supplier Part Number 1: TACTM-34N-F; Supplier 2: RS Components; Supplier 3: Farnell; Supplier 4: Mouser; Supplier 5: Digi-Key; Supplier 6: LCSC
U1 = UP_STM32L4A6VGT6: Manufacturer: STMicroelectronics; Value: STM32L4A6VGT6; Part Number: UP_STM32L4A6VGT6; HelpURL: https://www.st.com/resource/en/datasheet/stm32l4a6vg.pdf; Manufacturer Part Number: STM32L4A6VGT6; Supplier 1: TME; Supplier 2: RS Components; Supplier Part Number 2: 1894039; Supplier 3: Farnell; Supplier Part Number 3: 3129712; Supplier 4: Mouser; Supplier Part Number 4: 511-STM32L4A6VGT6; Supplier 5: Digi-Key; Supplier Part Number 5: 497-17732-ND; Supplier 6: LCSC
X2 = X_ABM3B-8.000MHZ-B2-T: Manufacturer: Abracon; Part Number: X_ABM3B-8.000MHZ-B2-T; Value: 8MHz; HelpURL: https://datasheet.octopart.com/ABM3B-8.000MHZ-B2-T-Abracon-datasheet-12510201.pdf; Supplier 1: TME; Supplier Part Number 1: ABM3B-8.000MHZ-B2; Supplier 2: RS Components; Supplier Part Number 2: 171-0644; Supplier 3: Farnell; Supplier Part Number 3: 2467818; Supplier 4: Mouser; Supplier Part Number 4: 815-ABM3B-8.0-B2-T; Supplier 5: Digi-Key; Supplier Part Number 5: 535-9720-1-ND; Supplier 6: LCSC

## Sheet STM32F103.SchDoc
size A3
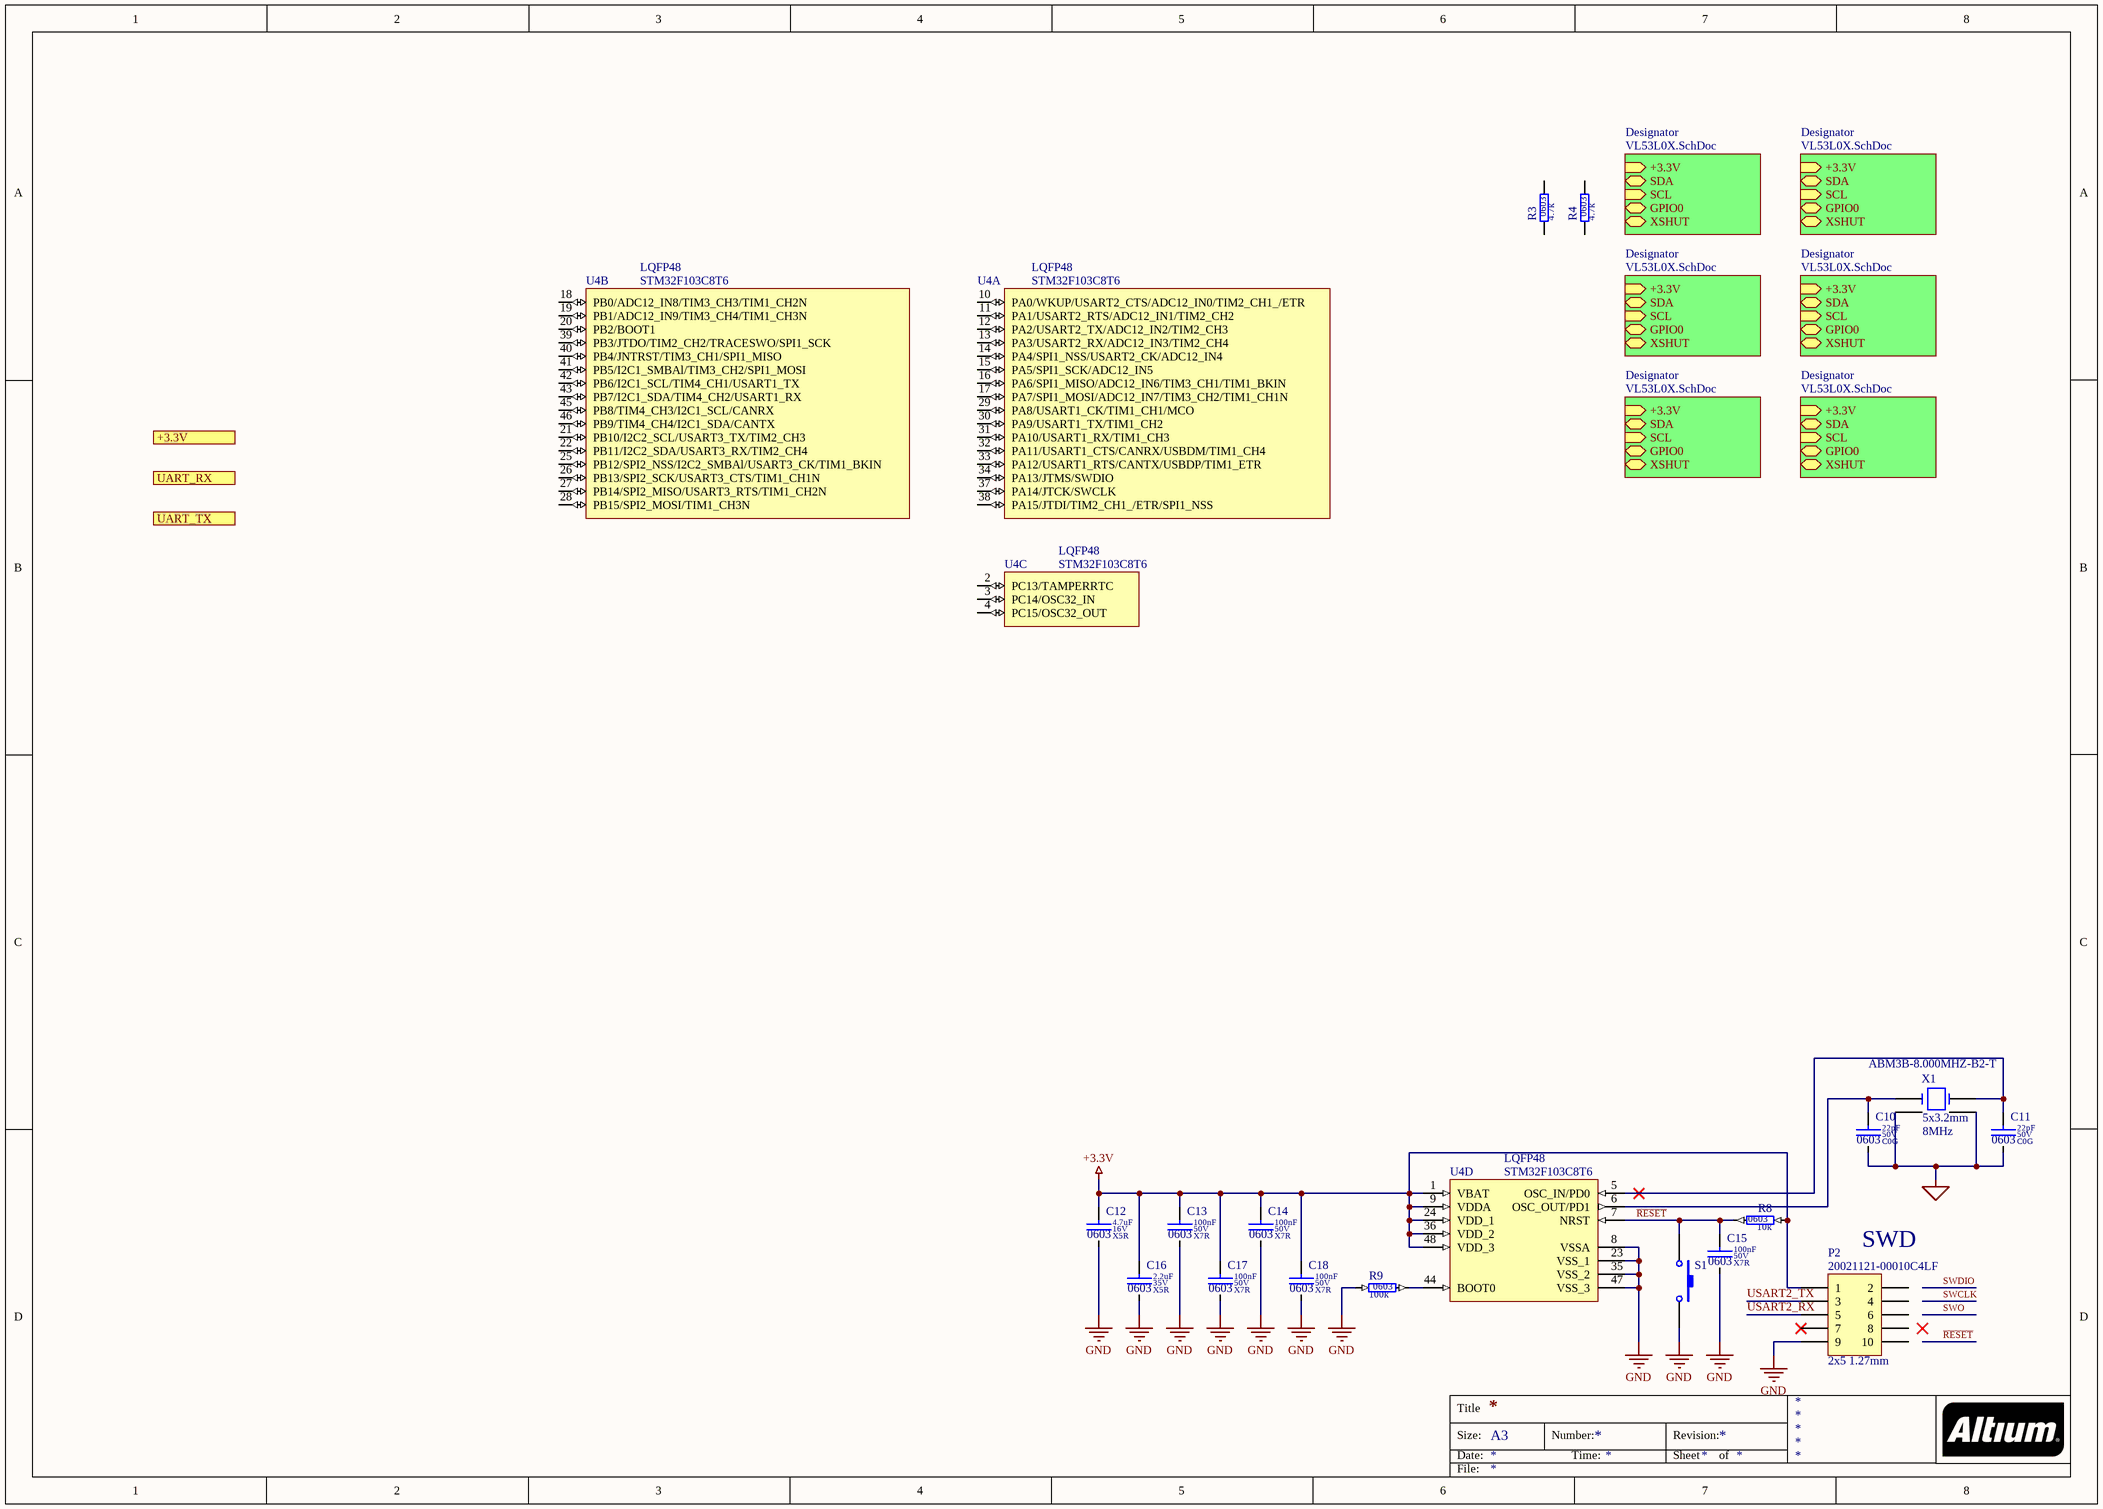
[diagram p4: STM32F103.SchDoc]

### Parts
C10  value 22pF  Dielectric: C0G  Voltage: 50V  SCH_Footprint: 0603  [C_0603_1608]  (hidden comment: Ceramic C0G)
C11  value 22pF  Dielectric: C0G  Voltage: 50V  SCH_Footprint: 0603  [C_0603_1608]  (hidden comment: Ceramic C0G)
C12  value 4.7uF  Dielectric: X5R  Voltage: 16V  SCH_Footprint: 0603  [C_0603_1608]  (hidden comment: Ceramic X5R)
C13  value 100nF  Dielectric: X7R  Voltage: 50V  SCH_Footprint: 0603  [C_0603_1608]  (hidden comment: Ceramic X7R)
C14  value 100nF  Dielectric: X7R  Voltage: 50V  SCH_Footprint: 0603  [C_0603_1608]  (hidden comment: Ceramic X7R)
C15  value 100nF  Dielectric: X7R  Voltage: 50V  SCH_Footprint: 0603  [C_0603_1608]  (hidden comment: Ceramic X7R)
C16  value 2.2uF  Dielectric: X5R  Voltage: 35V  SCH_Footprint: 0603  [C_0603_1608]  (hidden comment: Ceramic X5R)
C17  value 100nF  Dielectric: X7R  Voltage: 50V  SCH_Footprint: 0603  [C_0603_1608]  (hidden comment: Ceramic X7R)
C18  value 100nF  Dielectric: X7R  Voltage: 50V  SCH_Footprint: 0603  [C_0603_1608]  (hidden comment: Ceramic X7R)
P2  value 20021121-00010C4LF  SCH_Footprint: 2x5 1.27mm  [P_HEADER_2x5_1.27]  (hidden comment: Jtag)
R3  value 4.7k  SCH_Footprint: 0603  [R_0603_1608]  (hidden comment: Resistor)
R4  value 4.7k  SCH_Footprint: 0603  [R_0603_1608]  (hidden comment: Resistor)
R8  value 10k  SCH_Footprint: 0603  [R_0603_1608]  (hidden comment: Resistor)
R9  value 100k  SCH_Footprint: 0603  [R_0603_1608]  (hidden comment: Resistor)
S1  3x6mm  [S_TACTSWITCH3x6]  (value not drawn)
U4  SCH_Footprint: LQFP48  [LQFP48_7x7]  (hidden comment: STM32F103C8T6)  (parts A,B,C,D of 4)
X1  Manufacturer Part Number: ABM3B-8.000MHZ-B2-T  SCH_Footprint: 5x3.2mm  [X_ABM3B_5X3X11]  (hidden comment: 8MHz)

### Sub-sheets
Designator = VL53L0X.SchDoc: XSHUT (bidir), SDA (bidir), GPIO0 (bidir), +3.3V (in), SCL (in)
Designator = VL53L0X.SchDoc: XSHUT (bidir), SDA (bidir), GPIO0 (bidir), +3.3V (in), SCL (in)
Designator = VL53L0X.SchDoc: XSHUT (bidir), SDA (bidir), GPIO0 (bidir), +3.3V (in), SCL (in)
Designator = VL53L0X.SchDoc: XSHUT (bidir), SDA (bidir), GPIO0 (bidir), +3.3V (in), SCL (in)
Designator = VL53L0X.SchDoc: XSHUT (bidir), SDA (bidir), GPIO0 (bidir), +3.3V (in), SCL (in)
Designator = VL53L0X.SchDoc: XSHUT (bidir), SDA (bidir), GPIO0 (bidir), +3.3V (in), SCL (in)

### Ports
+3.3V (in), UART_RX (in), UART_TX (out)

### Nets
+3.3V: C12.1 C13.1 C14.1 C16.1 C17.1 C18.1 P2.1 R8.1 U4.1(VBAT) U4.9(VDDA) U4.24(VDD_1) U4.36(VDD_2) U4.48(VDD_3)
GND: C10.2 C11.2 C12.2 C13.2 C14.2 C15.2 C16.2 C17.2 C18.2 P2.9 R9.1 S1.2 U4.8(VSSA) U4.23(VSS_1) U4.35(VSS_2) U4.47(VSS_3) X1.2(GND) X1.4(GND)
~{RESET}: C15.1 R8.2 S1.1 U4.7(NRST)
USART2_RX: P2.5
USART2_TX: P2.3
NetC10_1: C10.1 U4.6(OSC_OUT/PD1) X1.3
NetC11_1: C11.1 U4.5(OSC_IN/PD0) X1.1
NetR9_2: R9.2 U4.44(BOOT0)

Not connected (* = marked no-connect by the designer): P2 2 4 6 7* 8 10; R3 1 2; R4 1 2; U4 2(PC13/TAMPERRTC) 3(PC14/OSC32_IN) 4(PC15/OSC32_OUT) 10(PA0/WKUP/USART2_CTS/ADC12_IN0/TIM2_CH1_/ETR) 11(PA1/USART2_RTS/ADC12_IN1/TIM2_CH2) 12(PA2/USART2_TX/ADC12_IN2/TIM2_CH3) 13(PA3/USART2_RX/ADC12_IN3/TIM2_CH4) 14(PA4/SPI1_NSS/USART2_CK/ADC12_IN4) 15(PA5/SPI1_SCK/ADC12_IN5) 16(PA6/SPI1_MISO/ADC12_IN6/TIM3_CH1/TIM1_BKIN) 17(PA7/SPI1_MOSI/ADC12_IN7/TIM3_CH2/TIM1_CH1N) 18(PB0/ADC12_IN8/TIM3_CH3/TIM1_CH2N) 19(PB1/ADC12_IN9/TIM3_CH4/TIM1_CH3N) 20(PB2/BOOT1) 21(PB10/I2C2_SCL/USART3_TX/TIM2_CH3) 22(PB11/I2C2_SDA/USART3_RX/TIM2_CH4) 25(PB12/SPI2_NSS/I2C2_SMBAl/USART3_CK/TIM1_BKIN) 26(PB13/SPI2_SCK/USART3_CTS/TIM1_CH1N) 27(PB14/SPI2_MISO/USART3_RTS/TIM1_CH2N) 28(PB15/SPI2_MOSI/TIM1_CH3N) 29(PA8/USART1_CK/TIM1_CH1/MCO) 30(PA9/USART1_TX/TIM1_CH2) 31(PA10/USART1_RX/TIM1_CH3) 32(PA11/USART1_CTS/CANRX/USBDM/TIM1_CH4) 33(PA12/USART1_RTS/CANTX/USBDP/TIM1_ETR) 34(PA13/JTMS/SWDIO) 37(PA14/JTCK/SWCLK) 38(PA15/JTDI/TIM2_CH1_/ETR/SPI1_NSS) 39(PB3/JTDO/TIM2_CH2/TRACESWO/SPI1_SCK) 40(PB4/JNTRST/TIM3_CH1/SPI1_MISO) 41(PB5/I2C1_SMBAl/TIM3_CH2/SPI1_MOSI) 42(PB6/I2C1_SCL/TIM4_CH1/USART1_TX) 43(PB7/I2C1_SDA/TIM4_CH2/USART1_RX) 45(PB8/TIM4_CH3/I2C1_SCL/CANRX) 46(PB9/TIM4_CH4/I2C1_SDA/CANTX)

### Notes on the sheet
- (near P2) SWD
- Title
- Size:
- Date:
- A3
- Number:
- Time:
- Revision:
- Sheet
- of
- File:

### Library data of the parts
C10 C11 = C_22pF_50V_C0G_0603_5: as C19 on sheet MAIN; Part Number: C_22pF_50V_C0G_0603_5; HelpURL: https://datasheet.octopart.com/CC0603JRNPO9BN220-Yageo-datasheet-136957424.pdf; Supplier 1: TME; Supplier Part Number 1: CC0603JRNPO9220; Supplier 2: RS Components; Supplier 3: Farnell; Supplier Part Number 3: 722005; Supplier 4: Mouser; Supplier Part Number 4: 603-CC603JRNPO9BN220; Supplier 5: Digi-Key; Supplier Part Number 5: 311-1062-1-ND; Supplier 6: LCSC
C12 = C_4.7uF_16V_X5R_0603_10: as C21 on sheet MAIN; Part Number: C_4.7uF_16V_X5R_0603_10; HelpURL: https://datasheet.octopart.com/GRM188R61C475KAAJD-Murata-datasheet-66077093.pdf; Supplier 1: TME; Supplier 2: RS Components; Supplier Part Number 2: 884-7264P; Supplier 3: Farnell; Supplier Part Number 3: 2611924; Supplier 4: Mouser; Supplier Part Number 4: 81-GRM188R61C475KAJD; Supplier 5: Digi-Key; Supplier Part Number 5: 490-10481-2-ND; Supplier 6: LCSC
C13-C15 C17 C18 = C_100nF_50V_X7R_0603_5: as C3 on sheet MAIN; Part Number: C_100nF_50V_X7R_0603_5; HelpURL: http://www.tme.eu/pl/Document/4a42202b32dab16128fe107dd69598cc/samsung-chip-cap.pdf; Supplier 1: TME; Supplier Part Number 1: CL10B104JB8NNNC; Supplier 2: RS Components; Supplier Part Number 2: 7665455; Supplier 3: Farnell; Supplier 4: Mouser; Supplier 5: Digi-Key; Supplier Part Number 5: 1276-1033-1-ND; Supplier 6: LCSC; Supplier Part Number 6: C24452
C16 = C_2.2uF_35V_X5R_0603_10: as C32 on sheet MAIN; Part Number: C_2.2uF_35V_X5R_0603_10; HelpURL: https://datasheet.octopart.com/GRM188R6YA225KA12D-Murata-datasheet-66077095.pdf; Supplier 1: TME; Supplier 2: RS Components; Supplier Part Number 2: 8151358; Supplier 3: Farnell; Supplier Part Number 3: 2611926; Supplier 4: Mouser; Supplier Part Number 4: 81-GRM188R6YA225KA2D; Supplier 5: Digi-Key; Supplier Part Number 5: 490-7204-1-ND; Supplier 6: LCSC
P2 = P_HEADER_2x5_1.27: Pin Header; Manufacturer: FCI; Part Number: P_HEADER_2x5_1.27; HelpURL: http://www.mouser.com/catalog/645/usd/1591.pdf; Manufacturer Part Number: 20021121-00010C4LF; Supplier 1: TME; Supplier Part Number 1: 20021121-00010C4LF; Supplier 2: RS Components; Supplier Part Number 2: 794-4584; Supplier 3: Farnell; Supplier Part Number 3: 1865279; Supplier 4: Mouser; Supplier Part Number 4: 649-202112100010C4LF; Supplier 5: Digi-Key; Supplier Part Number 5: 609-3695-1-ND; Supplier 6: LCSC
R3 R4 = R_4.7k_0603_1: as R5#1 on sheet MAIN; Part Number: R_4.7k_0603_1; HelpURL: http://www.farnell.com/datasheets/2167052.pdf?_ga=2.156163131.1690599162.1548417389-1379097396.1542296996&_gac=1.18389067.1547230258.Cj0KCQiAmuHhBRD0ARIsAFWyPwhX8HcvXnM3tA0ZBodZLzDIjH2ZxLpjT5LWo9bad_HPRbU8LfPq44UaAhEwEALw_wcB; Supplier 1: TME; Supplier Part Number 1: RC0603FR-074K7; Supplier 2: RS Components; Supplier 3: Farnell; Supplier Part Number 3: 9238565; Supplier 4: Mouser; Supplier Part Number 4: 603-RC0603FR-074K7L; Supplier 5: Digi-Key; Supplier Part Number 5: 311-4.70KHRCT-ND; Supplier 6: LCSC
R8 = R_10k_0603_1: as R1 on sheet MAIN; Part Number: R_10k_0603_1; HelpURL: http://www.tme.eu/pl/Document/622e28308c06d160637f2b14751ba16b/Data%20Sheet%20CRCW_BCe3.pdf; Supplier 1: TME; Supplier Part Number 1: CRCW060310K0FKTABC; Supplier 2: RS Components; Supplier 3: Farnell; Supplier 4: Mouser; Supplier Part Number 4: 667-ERJ-3EKF1002V; Supplier 5: Digi-Key; Supplier Part Number 5: P10KGCT-ND; Supplier 6: LCSC
R9 = R_100k_0603_1: as R11 on sheet MAIN; Part Number: R_100k_0603_1; HelpURL: http://www.tme.eu/pl/Document/b315665a56acbc42df513c99b390ad98/ROYALOHM-THICKFILM.pdf; Supplier 1: TME; Supplier Part Number 1: SMD0603-100K-1%; Supplier 2: RS Components; Supplier 3: Farnell; Supplier 4: Mouser; Supplier Part Number 4: 667-ERJ-3EKF1003V; Supplier 5: Digi-Key; Supplier Part Number 5: P100KHCT-ND; Supplier 6: LCSC
S1 = S_TACTSWITCH: as S2 on sheet MAIN; Part Number: S_TACTSWITCH; HelpURL: http://pl.ninigi.com/product/tactm-34n-f/pdf; Supplier 1: TME; Supplier Part Number 1: TACTM-34N-F; Supplier 2: RS Components; Supplier 3: Farnell; Supplier 4: Mouser; Supplier 5: Digi-Key; Supplier 6: LCSC
U4 = UP_STM32F103C8T6: Manufacturer: STMicroelectronics; Value: STM32F103C8T6; Part Number: UP_STM32F103C8T6; HelpURL: https://datasheet.octopart.com/STM32F103C8T6-STMicroelectronics-datasheet-48026265.pdf; Manufacturer Part Number: STM32F103C8T6; Supplier 1: TME; Supplier Part Number 1: STM32F103C8T6; Supplier 2: RS Components; Supplier Part Number 2: 1023545; Supplier 3: Farnell; Supplier Part Number 3: 1447637; Supplier 4: Mouser; Supplier Part Number 4: 511-STM32F103C8T6; Supplier 5: Digi-Key; Supplier Part Number 5: 497-6063-ND; Supplier 6: LCSC
X1 = X_ABM3B-8.000MHZ-B2-T: Manufacturer: Abracon; Part Number: X_ABM3B-8.000MHZ-B2-T; Value: 8MHz; HelpURL: https://datasheet.octopart.com/ABM3B-8.000MHZ-B2-T-Abracon-datasheet-12510201.pdf; Supplier 1: TME; Supplier Part Number 1: ABM3B-8.000MHZ-B2; Supplier 2: RS Components; Supplier Part Number 2: 171-0644; Supplier 3: Farnell; Supplier Part Number 3: 2467818; Supplier 4: Mouser; Supplier Part Number 4: 815-ABM3B-8.0-B2-T; Supplier 5: Digi-Key; Supplier Part Number 5: 535-9720-1-ND; Supplier 6: LCSC

## Sheet VL53L0X.SchDoc
size A4
Used 6 times, as channels Designator/Designator, Designator/Designator, Designator/Designator, Designator/Designator, Designator/Designator, Designator/Designator. Parts and nets are listed once, with the designators drawn on the sheet.
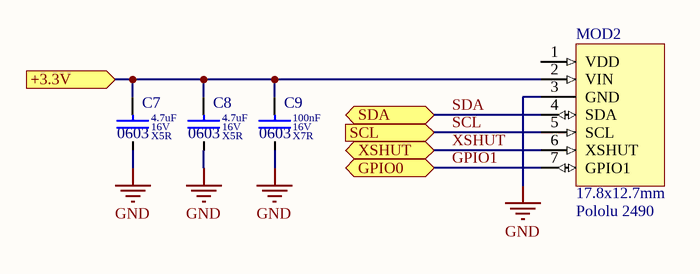
[diagram p5: VL53L0X.SchDoc]

### Parts
C7  value 4.7uF  Dielectric: X5R  Voltage: 16V  SCH_Footprint: 0603  [C_0603_1608]  (hidden comment: Ceramic X5R)
C8  value 4.7uF  Dielectric: X5R  Voltage: 16V  SCH_Footprint: 0603  [C_0603_1608]  (hidden comment: Ceramic X5R)
C9  value 100nF  Dielectric: X7R  Voltage: 16V  SCH_Footprint: 0603  [C_0603_1608]  (hidden comment: Ceramic X7R)
MOD2  value Pololu 2490  SCH_Footprint: 17.8x12.7mm  [MOD_VL53L0X]  (hidden comment: time-of-flight)

### Ports
+3.3V (in), GPIO0 (bidir), SCL (in), SDA (bidir), XSHUT (bidir)

### Nets
GND: C7.2 C8.2 C9.2 MOD2.3(GND)
+3.3V: C7.1 C8.1 C9.1 MOD2.2(VIN) ; port +3.3V
GPIO1: MOD2.7(GPIO1) ; port GPIO0
SCL: MOD2.5(SCL) ; port SCL
SDA: MOD2.4(SDA) ; port SDA
XSHUT: MOD2.6(XSHUT) ; port XSHUT

Not connected (* = marked no-connect by the designer): MOD2 1(VDD)

### Channels
Designator/Designator: designators C7=C82 C8=C83 C9=C84 MOD2=MOD12; ports +3.3V=NetC82_1 GPIO0=GPIO1_Designator SCL=SCL_Designator SDA=SDA_Designator XSHUT=XSHUT_Designator
Designator/Designator: designators C7=C79 C8=C80 C9=C81 MOD2=MOD11; ports +3.3V=NetC79_1 GPIO0=GPIO1_Designator SCL=SCL_Designator SDA=SDA_Designator XSHUT=XSHUT_Designator
Designator/Designator: designators C7=C76 C8=C77 C9=C78 MOD2=MOD10; ports +3.3V=NetC76_1 GPIO0=GPIO1_Designator SCL=SCL_Designator SDA=SDA_Designator XSHUT=XSHUT_Designator
Designator/Designator: designators C7=C73 C8=C74 C9=C75 MOD2=MOD9; ports +3.3V=NetC73_1 GPIO0=GPIO1_Designator SCL=SCL_Designator SDA=SDA_Designator XSHUT=XSHUT_Designator
Designator/Designator: designators C7=C70 C8=C71 C9=C72 MOD2=MOD8; ports +3.3V=NetC70_1 GPIO0=GPIO1_Designator SCL=SCL_Designator SDA=SDA_Designator XSHUT=XSHUT_Designator
Designator/Designator: designators C7=C67 C8=C68 C9=C69 MOD2=MOD7; ports +3.3V=NetC67_1 GPIO0=GPIO1_Designator SCL=SCL_Designator SDA=SDA_Designator XSHUT=XSHUT_Designator

### Library data of the parts
C7 C8 = C_4.7uF_16V_X5R_0603_10: as C21 on sheet MAIN; Part Number: C_4.7uF_16V_X5R_0603_10; HelpURL: https://datasheet.octopart.com/GRM188R61C475KAAJD-Murata-datasheet-66077093.pdf; Supplier 1: TME; Supplier 2: RS Components; Supplier Part Number 2: 884-7264P; Supplier 3: Farnell; Supplier Part Number 3: 2611924; Supplier 4: Mouser; Supplier Part Number 4: 81-GRM188R61C475KAJD; Supplier 5: Digi-Key; Supplier Part Number 5: 490-10481-2-ND; Supplier 6: LCSC
C9 = C_100nF_16V_X7R_0603_10: Capacitor; Manufacturer: Kemet; Manufacturer Part Number: C0603C104K4RAC7013; Tolerance (%): 10; Part Number: C_100nF_16V_X7R_0603_10; HelpURL: https://pl.mouser.com/datasheet/2/212/KEM_C1002_X7R_SMD-1102033.pdf; Supplier 1: TME; Supplier 2: RS Components; Supplier 3: Farnell; Supplier 4: Mouser; Supplier Part Number 4: 80-C0603C104K4RC7013; Supplier 5: Digi-Key; Supplier Part Number 5: 399-7372-2-ND; Supplier 6: LCSC
MOD2 = MOD_VL53L0X: Pin Header; Manufacturer: Polulu; Part Number: MOD_VL53L0X; HelpURL: https://www.pololu.com/file/download/VL53L0X.pdf?file_id=0J1187; Manufacturer Part Number: Pololu 2490; Supplier 1: TME; Supplier 2: RS Components; Supplier 3: Farnell; Supplier 4: Mouser; Supplier 5: Digi-Key; Supplier 6: LCSC; Supplier 7: Botland; Supplier Part Number 7: PLL-07176